# EAGLE schematic CEM-8bit-PCA9557 (EAGLE 6.3)
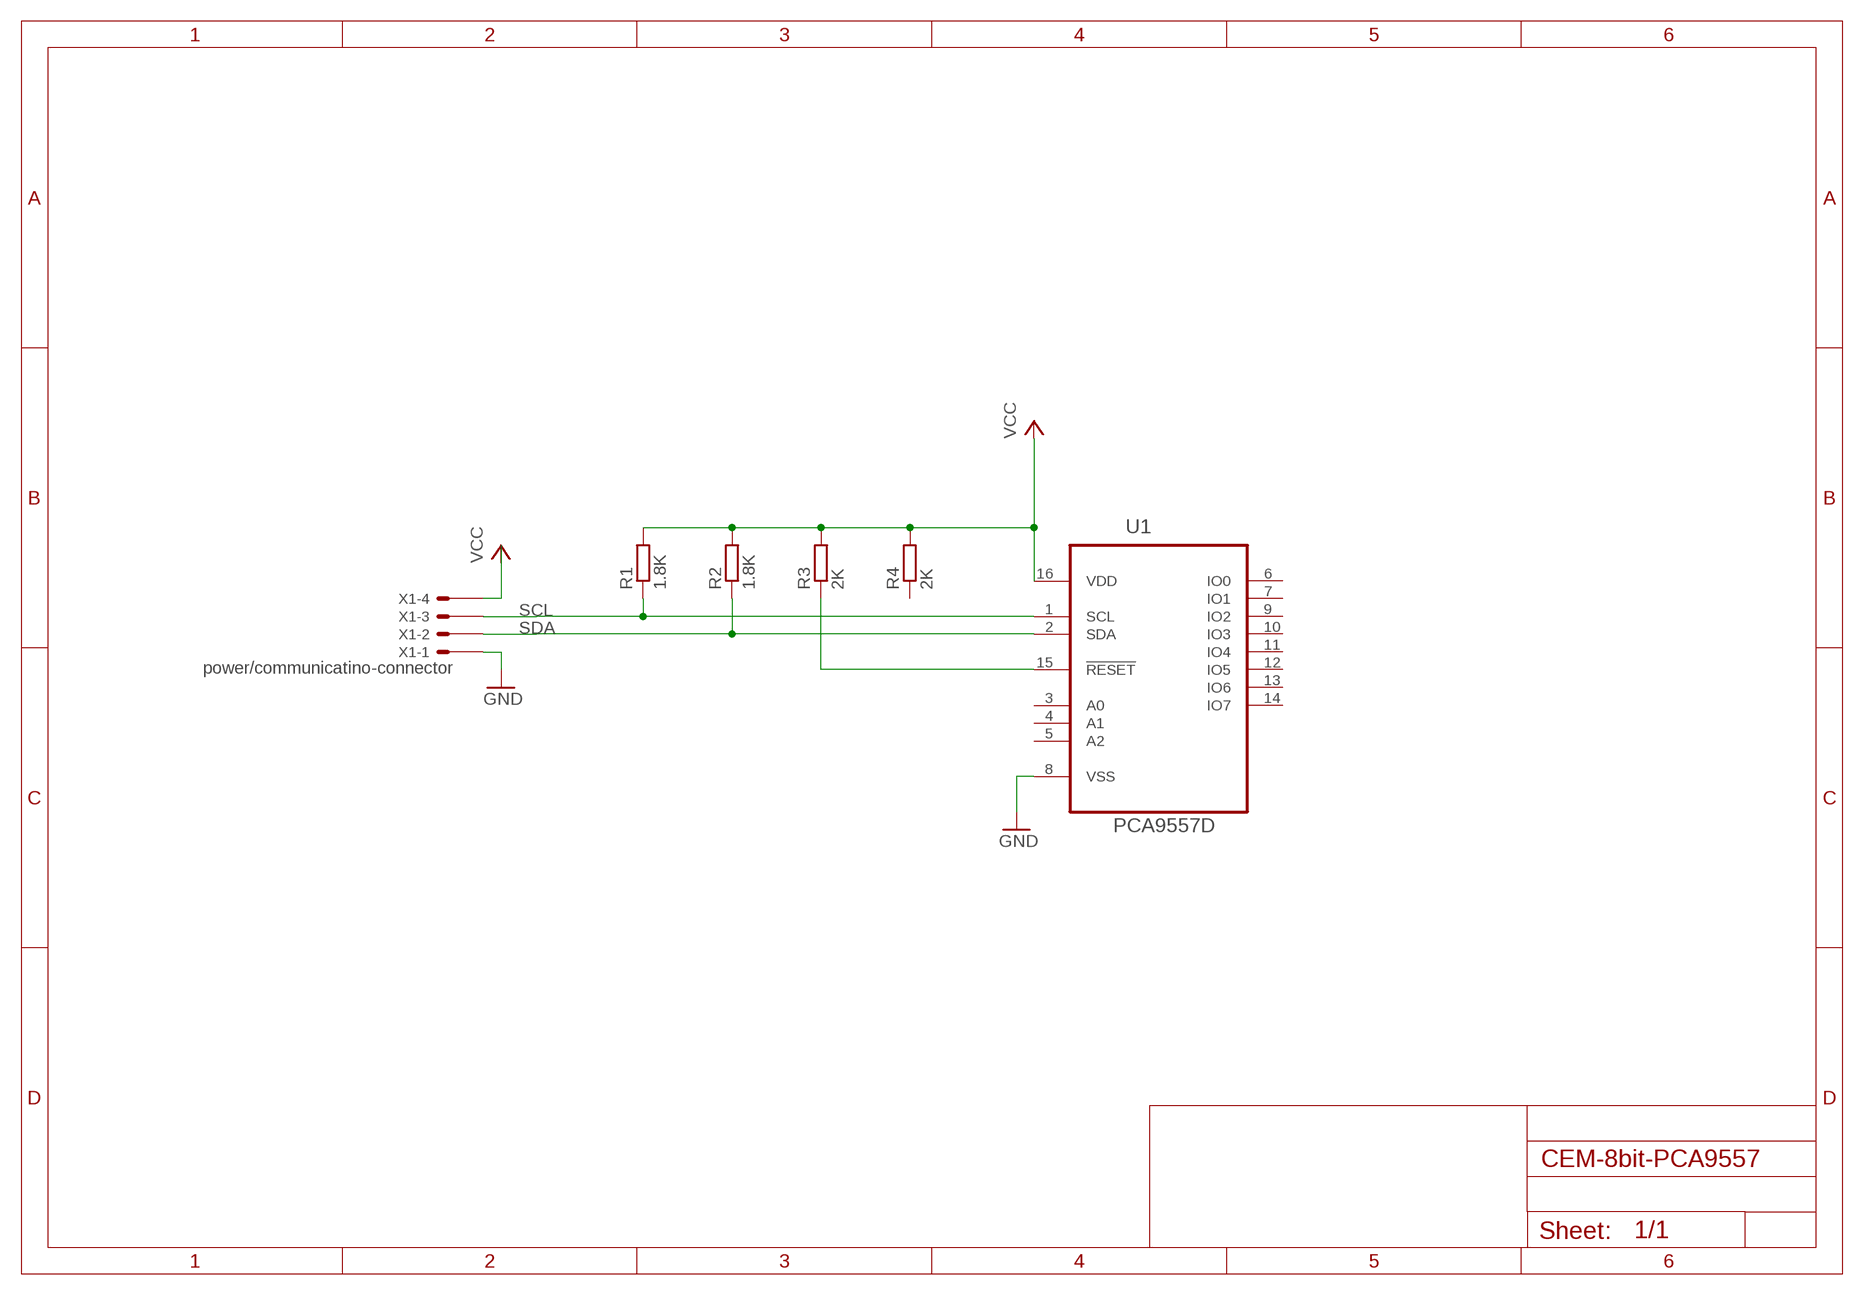
[diagram p0: schematic, sheet 1]

## Parts
R1  1.8K  R-EU_MELF0204R  [MINI_MELF-0204R]
R2  1.8K  R-EU_MELF0204R  [MINI_MELF-0204R]
R3  2K  R-EU_MELF0204R  [MINI_MELF-0204R]
R4  2K  R-EU_MELF0204R  [MINI_MELF-0204R]
U1  PCA9557D  [SOIC127P600X175-16N]
X1  power/communicatino-connector  43160-1104  [43160-XX04]

## Nets
GND: U1.8(VSS) X1.1@1(-1:S)
N$3: R3.1 U1.15(!RESET)
SCL: R1.1 U1.1(SCL) X1.3@1(-3:S)
SDA: R2.1 U1.2(SDA) X1.2@1(-2:S)
VCC: R1.2 R2.2 R3.2 R4.2 U1.16(VDD) X1.4@1(-4:S)
Unconnected: R4.1 U1.3(A0) U1.4(A1) U1.5(A2) U1.6(IO0) U1.7(IO1) U1.9(IO2) U1.10(IO3) U1.11(IO4) U1.12(IO5) U1.13(IO6) U1.14(IO7) X1.1@2(-1:S) X1.2@2(-2:S) X1.3@2(-3:S) X1.4@2(-4:S)

## Library data of the parts
R1-R4 = resistor:R-EU_: RESISTOR, European symbol
U1 = PCA9557:PCA9557D: IC, IO PORT, I2C/SMBUS, 8BIT, 16SOIC; MPN: PCA9557D; OC_FARNELL: 2212102; OC_NEWARK: 55W4327; PACKAGE: SO-16; SUPPLIER: NXP
X1 = con-molex:43160-*04: SDA-43160 Connector Source: http://www.molex.com/pdm_docs/sd/431601306_sd.pdf; MF: WALDOM/MOLEX; MPN: 43160-1104; OC_FARNELL: unknown; OC_NEWARK: 54H0257